# EasyEDA Pro project ProPrj_51单片机核心板_2025-11-10-23-27-29.epro

# Schematic 51单片机核心板原理图
Board Name: 51单片机核心板; Create Date: 2025-10-25; Page Name: P1; Project Name: 51单片机核心板; Schematic Name: 51单片机核心板原理图; Update Date: 2025-10-27; Company: HFUT; Drawed: 孟一冉; Page Size: A4; Version: V1.0
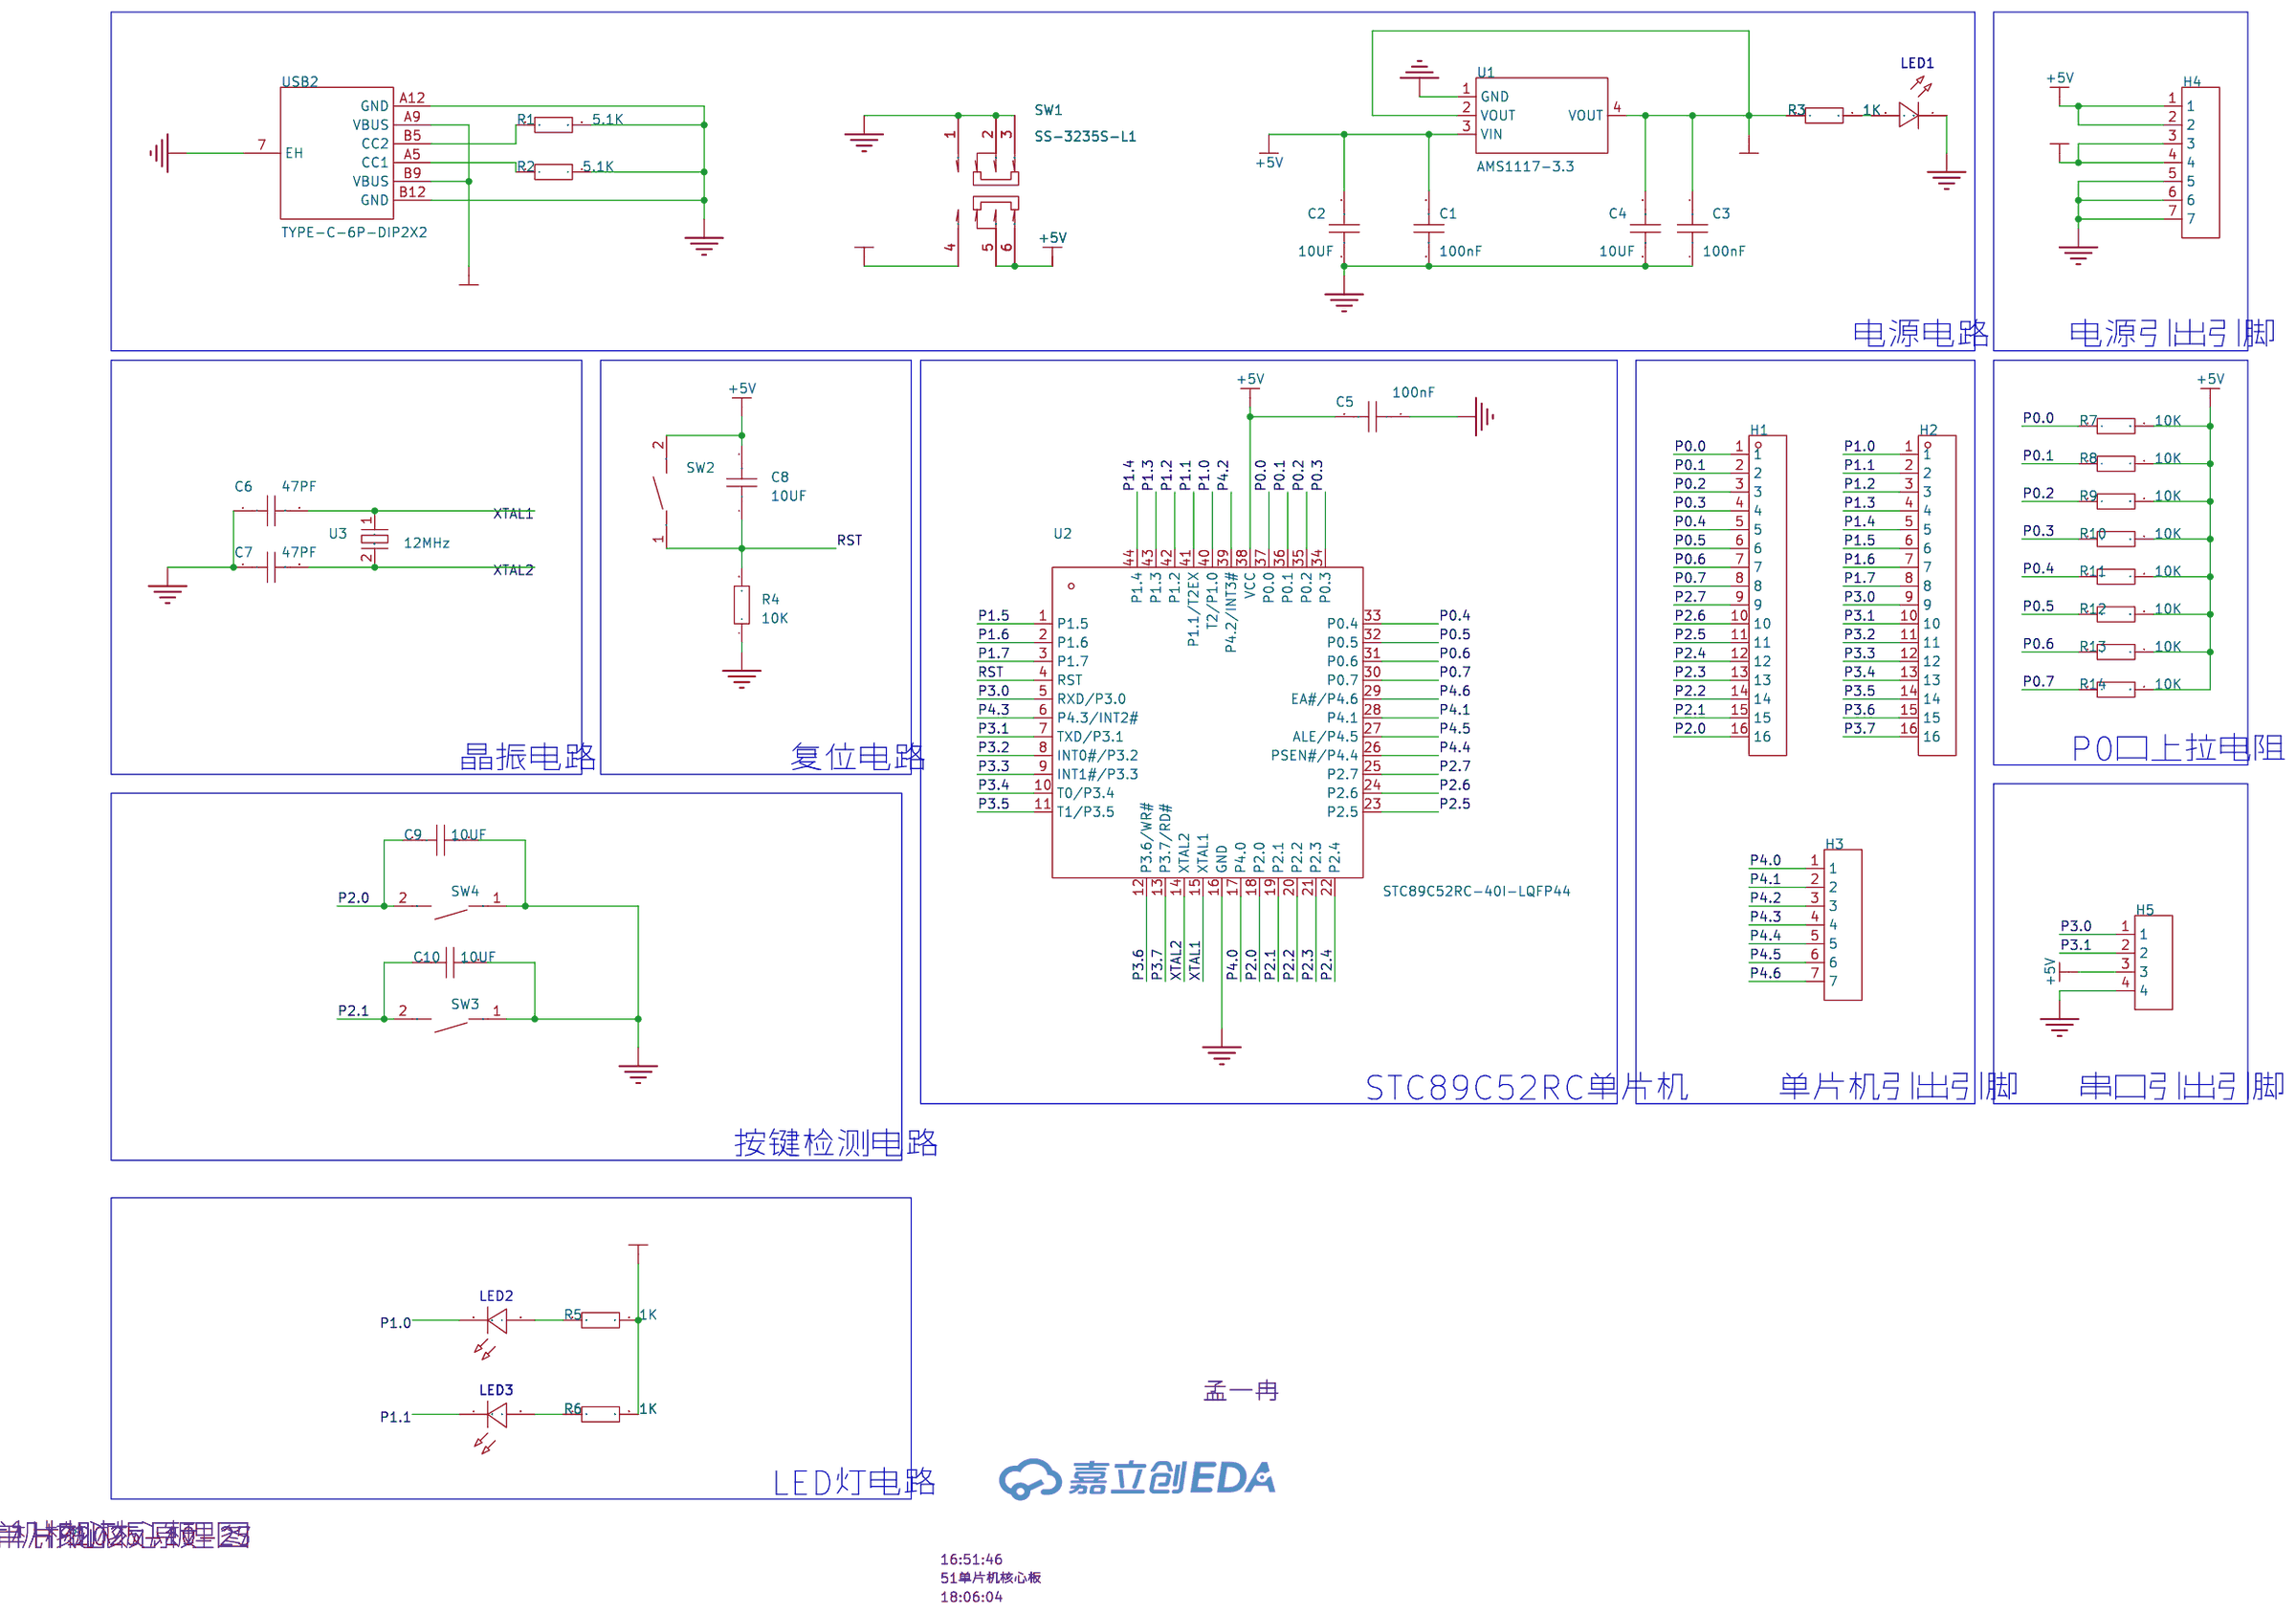
[diagram p0: schematic sheet]

## Parts
C1  100nF  [C0805]
C2  10UF  [C0805]
C3  100nF  [C0805]
C4  10UF  [C0805]
C5  100nF  [C0805]
C6  47PF  [C0805]
C7  47PF  [C0805]
C8  10UF  [C0805]
C9  10UF  [C0805]
C10  10UF  [C0805]
H1  -  [HDR-TH_16P-P2.54-V-M]
H2  -  [HDR-TH_16P-P2.54-V-M]
H3  -  [HDR-TH_7P-P2.54-V-M]
H4  -  [HDR-TH_7P-P2.54-V-M]
H5  -  [HDR-TH_4P-P2.54-V-M]
LED1  -  [LED_0805]
LED2  -  [LED_0805]
LED3  -  [LED_0805]
R1  5.1K  [R0805]
R2  5.1K  [R0805]
R3  1K  [R0805]
R4  10K  [R0805]
R5  1K  [R0805]
R6  1K  [R0805]
R7  10K  [R0805]
R8  10K  [R0805]
R9  10K  [R0805]
R10  10K  [R0805]
R11  10K  [R0805]
R12  10K  [R0805]
R13  10K  [R0805]
R14  10K  [R0805]
SW1  SS-3235S-L1  [SW-SMD_SS-3235S-LX]
SW2  轻触按键3*4*H  [SW-SMD_L4.0-W2.9-LS5.0]
SW3  轻触按键3*4*H  [SW-SMD_L4.0-W2.9-LS5.0]
SW4  轻触按键3*4*H  [SW-SMD_L4.0-W2.9-LS5.0]
U1  AMS1117-3.3  [SOT-223-3_L6.5-W3.4-P2.30-LS7.0-BR]
U2  STC89C52RC-40I-LQFP44  [LQFP-44_L10.0-W10.0-P0.80-LS12.0-BL]
U3  12MHz  [CRYSTAL-SMD_L11.4-W4.7-LS12.7]
USB2  TYPE-C-6P-DIP2X2  [TYPE-C-SMD_TYPE-C-6P]

## Library data of the parts
C1-C10 = CAP_0805: Supplier Footprint: 0805
H1 H2 = HDR-M_2.54_1x16P: 间距:2.54mm;总PIN位数:16;排数:1;插针结构:1x16P;行距:-;安装类型:直插;圆针/方针:方针;额定电流:3A;额定电压:-;配合针长度:6mm;塑高:2.5mm;端接针长度:3mm;触头材质:-;工作温度范围:-40℃~+105℃;颜色:黑色;; Supplier Part: C2894939; Supplier Footprint: 插件
H3 H4 = HDR-M_2.54_1x7P: Supplier Part: C492406; Supplier Footprint: 插件
H5 = HDR-M_2.54_1x4P: Supplier Part: C492403; Supplier Footprint: 插件
LED1-LED3 = LED_0805-G: Supplier Footprint: 0805
R1-R14 = Res_0805: Supplier Footprint: 0805
SW1 = SS-3235S-L1: 电路结构:双刀双掷;安装方式:卧贴;开关颜色:黑色;额定电流:50mA;额定电压:12V;工作寿命:1万次;; LCSC Part Name: 柄长2mm 卧贴双档 滑动开关; Supplier Part: C500055; Manufacturer: XKB Connection(中国星坤); Supplier Footprint: SMD,9.1x3.6mm; JLCPCB Part Class: 扩展库; Datasheet: https://item.szlcsc.com/datasheet/SS-3235S-L1/512181.html; Supplier: LCSC; Circuit: 双刀双掷; Actuator Style: 矩形柱状; Termination Style: 鸥翼型; Length: 9.1mm; Width: 3.55mm; Switch Height: 3.2mm; Mounting Type: 卧贴; Actuator Color: 黑色; Current Rating: 50mA; Voltage Rating: 12V; Life: 1万次; Operating Temperature: -40℃~+85℃
SW2-SW4 = 轻触按键3*4*H: Supplier Part: C9900017573; Supplier Footprint: 轻触按键3*4*2.5; JLCPCB Part Class: 扩展库; Supplier: LCSC
U1 = AMS1117-3.3_C6186: 输出类型:固定;工作电压:16V;输出电压:3.3V;输出电流:1A;电源纹波抑制比(PSRR):72dB@(120Hz);输出极性:正极;; LCSC Part Name: 输出3.3V 1A; Supplier Part: C6186; Manufacturer: AMS; Supplier Footprint: SOT-223; JLCPCB Part Class: 基础库; Datasheet: https://item.szlcsc.com/datasheet/AMS1117-3.3/6652.html; Supplier: LCSC; Output Type: 固定; Voltage - Supply: 16V; Output Voltage: 3.3V; Output Current: 1A; Power Supply Rejection Ratio (PSRR): 72dB@(120Hz); Voltage Dropout: 1.1V@(800mA); standby current: 5mA; Noise: 0.003%Vout; Features: 过流保护；过热保护; Operating Temperature: -40℃~+125℃; Output Configuration: 正极; Number of Outputs: 1
U2 = STC89C52RC-40I-LQFP44: CPU内核:51系列;应用领域:-;; Supplier Part: C8707; Manufacturer: STC; Supplier Footprint: LQFP-44(10x10); JLCPCB Part Class: 扩展库; Datasheet: https://atta.szlcsc.com/upload/public/pdf/source/20241226/242305099CBBF4767F79975207B2F263.pdf; Supplier: LCSC; CPU Core: 51系列; Program Storage Size: 8KB; Program Memory Type: FLASH; Number of I/O: 39; Low Voltage Detection Threshold: 3.3V~5.5V
U3 = ABLS-12.000MHZ-B4H-T: 频率:12MHz;常温频差:±30ppm;外接负载电容:18pF;频率稳定度(全温):±35ppm;; LCSC Part Name: 12MHz ±30ppm 18pF; Supplier Part: C1986452; Manufacturer: ABRACON; Supplier Footprint: HC-49S-SMD; JLCPCB Part Class: 扩展库; Datasheet: https://atta.szlcsc.com/upload/public/pdf/source/20210612/96A8D0E14BE5C26ADD56CBF11909D043.pdf; Supplier: LCSC; Normal temperature Frequency Tolerance: ±30ppm; External load capacitor: 18pF; Frequency Stability(Full temperature range): ±35ppm; Equivalent Series Resistance (ESR): 50Ω; Operating Temperature: -20℃~+70℃
USB2 = TYPE-C-6P-DIP2X2: Supplier Part: C9900017627; Supplier Footprint: TYPE-C-6P; JLCPCB Part Class: 扩展库; Supplier: LCSC

## Nets
+3.3V: C3.2 C4.2 H4.3 H4.4 R3.1 R5.2 R6.2 U1.2(VOUT) U1.4(VOUT)
+5V: C1.2 C2.2 C5.2 C8.2 H4.1 H4.2 H5.3 R7.2 R8.2 R9.2 R10.2 R11.2 R12.2 R13.2 R14.2 SW1.5 SW1.6 SW2.2 U1.3(VIN) U2.38(VCC)
GND: C1.1 C2.1 C3.1 C4.1 C5.1 C6.1 C7.1 C9.2 C10.2 H4.5 H4.6 H4.7 H5.4 LED1.1(C) R1.2 R2.2 R4.1 SW1.1 SW1.2 SW1.3 SW3.1 SW4.1 U1.1(GND) U2.16(GND) USB2.7(EH) USB2.A12(GND) USB2.B12(GND)
VCC+5V: SW1.4 USB2.A9(VBUS) USB2.B9(VBUS)
P0.0: H1.1 R7.1 U2.37(P0.0)
P0.1: H1.2 R8.1 U2.36(P0.1)
P0.2: H1.3 R9.1 U2.35(P0.2)
P0.3: H1.4 R10.1 U2.34(P0.3)
P0.4: H1.5 R11.1 U2.33(P0.4)
P0.5: H1.6 R12.1 U2.32(P0.5)
P0.6: H1.7 R13.1 U2.31(P0.6)
P0.7: H1.8 R14.1 U2.30(P0.7)
P1.0: H2.1 LED2.1(C) U2.40(T2/P1.0)
P1.1: H2.2 LED3.1(C) U2.41(P1.1/T2EX)
P1.2: H2.3 U2.42(P1.2)
P1.3: H2.4 U2.43(P1.3)
P1.4: H2.5 U2.44(P1.4)
P1.5: H2.6 U2.1(P1.5)
P1.6: H2.7 U2.2(P1.6)
P1.7: H2.8 U2.3(P1.7)
P2.0: C9.1 H1.16 SW4.2 U2.18(P2.0)
P2.1: C10.1 H1.15 SW3.2 U2.19(P2.1)
P2.2: H1.14 U2.20(P2.2)
P2.3: H1.13 U2.21(P2.3)
P2.4: H1.12 U2.22(P2.4)
P2.5: H1.11 U2.23(P2.5)
P2.6: H1.10 U2.24(P2.6)
P2.7: H1.9 U2.25(P2.7)
P3.0: H2.9 H5.1 U2.5(RXD/P3.0)
P3.1: H2.10 H5.2 U2.7(TXD/P3.1)
P3.2: H2.11 U2.8(INT0#/P3.2)
P3.3: H2.12 U2.9(INT1#/P3.3)
P3.4: H2.13 U2.10(T0/P3.4)
P3.5: H2.14 U2.11(T1/P3.5)
P3.6: H2.15 U2.12(P3.6/WR#)
P3.7: H2.16 U2.13(P3.7/RD#)
P4.0: H3.1 U2.17(P4.0)
P4.1: H3.2 U2.28(P4.1)
P4.2: H3.3 U2.39(P4.2/INT3#)
P4.3: H3.4 U2.6(P4.3/INT2#)
P4.4: H3.5 U2.26(PSEN#/P4.4)
P4.5: H3.6 U2.27(ALE/P4.5)
P4.6: H3.7 U2.29(EA#/P4.6)
RST: C8.1 R4.2 SW2.1 U2.4(RST)
XTAL1: C6.2 U2.15(XTAL1) U3.1
XTAL2: C7.2 U2.14(XTAL2) U3.2(GND)
Net-(LED1-2): LED1.2(A) R3.2
Net-(LED2-2): LED2.2(A) R5.1
Net-(LED3-2): LED3.2(A) R6.1
Net-(R1-1): R1.1 USB2.B5(CC2)
Net-(R2-1): R2.1 USB2.A5(CC1)

## Notes on the sheet
- 电源电路
- 电源引出引脚
- 晶振电路
- 复位电路
- P0口上拉电阻
- STC89C52RC单片机
- 单片机引出引脚
- 串口引出引脚
- 按键检测电路
- LED灯电路

# Board 51单片机核心板PCB
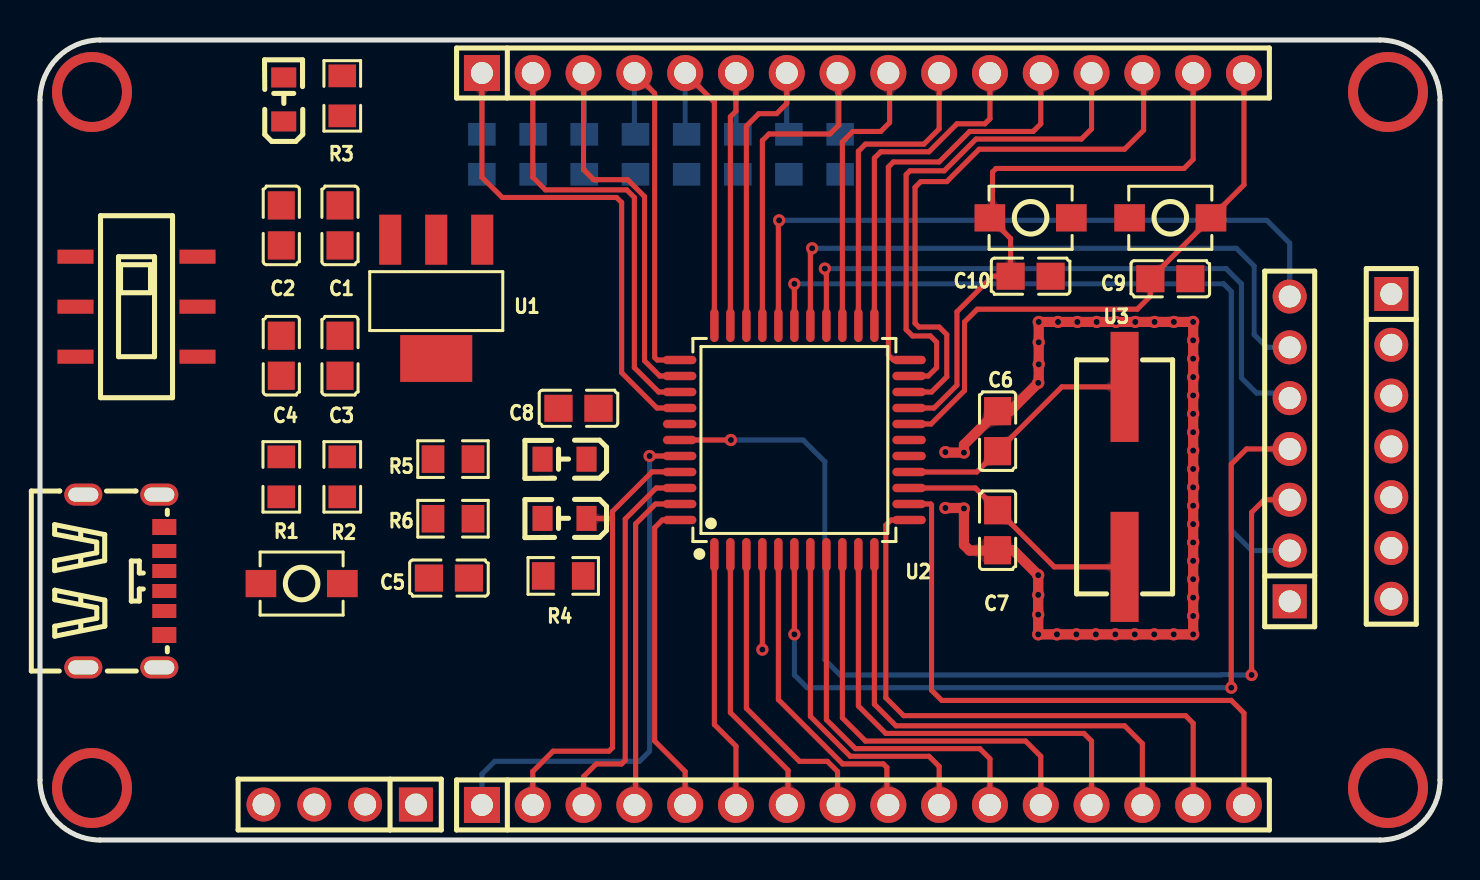
[diagram p1: board, top side]
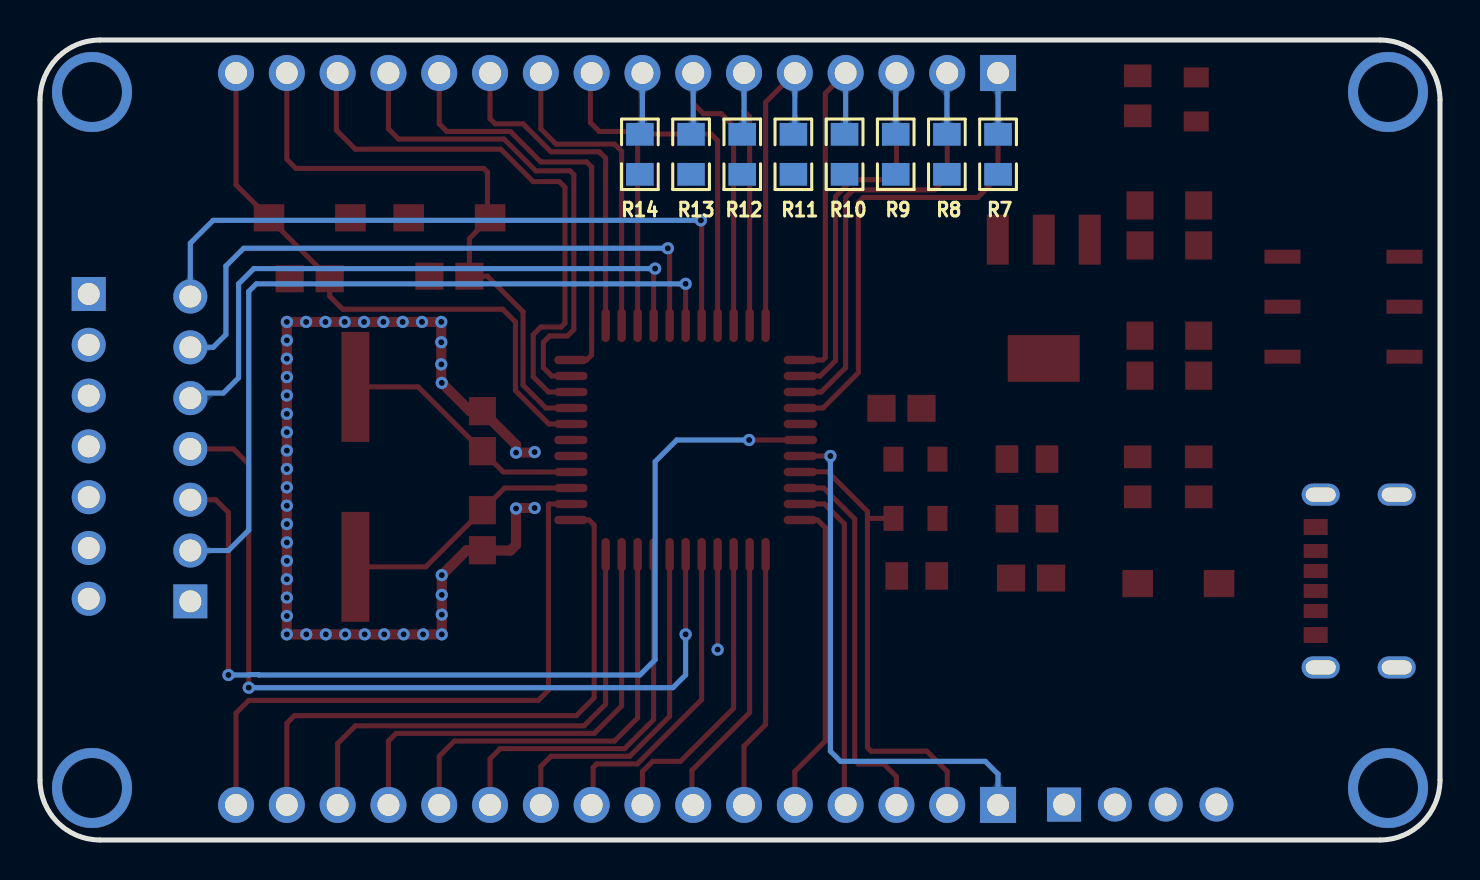
[diagram p2: board, bottom side, seen from below]

Outline 70 x 40 mm; copper layers: Top Layer, Bottom Layer. Coordinates in mm from the lower left corner of the outline.
Outline path: 0,37 0,3 arc(0.88,0.88) 3,0 67,0 arc(69.12,0.88) 70,3 70,37 arc(69.12,39.12) 67,40 3,40 arc(0.88,39.12) 0,37
Stack: Top Layer 0.035mm / Dielectric1 1.51mm FR4 er 4.5 / Bottom Layer 0.035mm

## Design rules (mm)
net XTAL1: DP1
net XTAL2: DP1
template: JLCPCB Capability(Two Layers Board)
spacing copperThickness1oz (default): track to track 0.102, other pairs 0.152 to 0.3
spacing copperThickness2oz: track to track 0.203, other pairs 0.152 to 0.3
track width copperThickness1oz (default): min 0.127, default 0.254, max 2.54
track width copperThickness2oz: min 0.203, default 0.254, max 2.54
differential pair differentialPair (default): width min 0.127, default 0.254, max 2.54; gap min 0.152, default 0.152
via viaSize (default): diameter min 0.5, default 0.61, max 10; hole min 0.3, default 0.305, max 6.3

## Placement (name value [footprint] x y rotation side)
C1  100nF  [C0805]  15 30.73 90 top
C2  10UF  [C0805]  12.06 30.73 90 top
C3  100nF  [C0805]  15 24.21 90 top
C4  10UF  [C0805]  12.06 24.21 90 top
C5  100nF  [C0805]  20.45 13.1 180 top
C6  47PF  [C0805]  47.88 20.44 270 top
C7  47PF  [C0805]  47.88 15.49 90 top
C8  10UF  [C0805]  26.92 21.58 0 top
C9  10UF  [C0805]  56.51 28.06 0 top
C10  10UF  [C0805]  49.53 28.19 0 top
NOREF  -  [HDR-TH_7P-P2.54-V-M]  62.48 19.55 90 top
NOREF#2  -  [HDR-TH_7P-P2.54-V-M]  67.56 19.68 270 top
NOREF#3  -  [SW-SMD_SS-3235S-LX]  4.83 26.67 90 top
NOREF#4  -  [SW-SMD_L4.0-W2.9-LS5.0]  13.08 12.82 180 top
NOREF#5  -  [SW-SMD_L4.0-W2.9-LS5.0]  49.53 31.11 180 top
NOREF#6  -  [SW-SMD_L4.0-W2.9-LS5.0]  56.51 31.11 0 top
NOREF#7  -  [HDR-TH_16P-P2.54-V-M]  41.15 38.35 0 top
NOREF#8  -  [HDR-TH_16P-P2.54-V-M]  41.15 1.75 0 top
NOREF#9  -  [LED_0805]  12.19 37.08 90 top
NOREF#10  -  [LED_0805]  26.18 19.05 180 top
NOREF#11  -  [LED_0805]  26.18 16.08 180 top
NOREF#12  -  [HDR-TH_4P-P2.54-V-M]  14.99 1.77 180 top
NOREF#13  -  [TYPE-C-SMD_TYPE-C-6P]  4.19 12.95 270 top
R1  5.1K  [R0805]  12.06 18.16 270 top
R2  5.1K  [R0805]  15.11 18.16 270 top
R3  1K  [R0805]  15.11 37.21 90 top
R4  10K  [R0805]  26.16 13.2 0 top
R5  1K  [R0805]  20.65 19.05 180 top
R6  1K  [R0805]  20.65 16.06 180 top
R7  10K  [R0805]  22.1 34.28 270 bottom
R8  10K  [R0805]  24.66 34.28 270 bottom
R9  10K  [R0805]  27.21 34.28 270 bottom
R10  10K  [R0805]  29.77 34.28 270 bottom
R11  10K  [R0805]  32.33 34.28 270 bottom
R12  10K  [R0805]  34.89 34.28 270 bottom
R13  10K  [R0805]  37.45 34.28 270 bottom
R14  10K  [R0805]  40 34.28 270 bottom
U1  AMS1117-3.3  [SOT-223-3_L6.5-W3.4-P2.30-LS7.0-BR]  19.81 27.05 90 top
U2  STC89C52RC-40I-LQFP44  [LQFP-44_L10.0-W10.0-P0.80-LS12.0-BL]  37.72 20 0 top
U3  12MHz  [CRYSTAL-SMD_L11.4-W4.7-LS12.7]  54.23 18.16 270 top

## Footprints (pads in the part's own frame, mm; a bottom-side part is the same pattern mirrored in y, then rotated)
C0805
  rect 1.41x1.35 smd: 1(-1,0) 2(1,0)
CRYSTAL-SMD_L11.4-W4.7-LS12.7
  rect 5.5x1.4 smd: 1(-4.5,0) 2(4.5,0)
HDR-TH_4P-P2.54-V-M
  rect 1.7x1.7 hole 1.1: 1(-3.81,0)
  round 1.7 hole 1.1: 2(-1.27,0) 3(1.27,0) 4(3.81,0)
HDR-TH_7P-P2.54-V-M
  rect 1.7x1.7 hole 1.1: 1(-7.62,0)
  round 1.7 hole 1.1: 2(-5.08,0) 3(-2.54,0) 4(0,0) 5(2.54,0) 6(5.08,0) 7(7.62,0)
HDR-TH_16P-P2.54-V-M
  rect 1.8x1.8 hole 1.1: 1(-19.05,0)
  round 1.8 hole 1.1: 2(-16.51,0) 3(-13.97,0) 4(-11.43,0) 5(-8.89,0) 6(-6.35,0) 7(-3.81,0) 8(-1.27,0) 9(1.27,0) 10(3.81,0) 11(6.35,0) 12(8.89,0) 13(11.43,0) 14(13.97,0) 15(16.51,0) 16(19.05,0)
LED_0805
  rect 1x1.25 smd: 1(-1.15,0.005) 2(1.05,0.005)
LQFP-44_L10.0-W10.0-P0.80-LS12.0-BL
  oval 0.42x1.67 smd: 1(-4,-5.735) 2(-3.2,-5.735) 3(-2.4,-5.735) 4(-1.6,-5.735) 5(-0.8,-5.735) 6(0,-5.735) 7(0.8,-5.735) 8(1.6,-5.735) 9(2.4,-5.735) 10(3.2,-5.735) 11(4,-5.735) 23(4,5.735) 24(3.2,5.735) 25(2.4,5.735) 26(1.6,5.735) 27(0.8,5.735) 28(0,5.735) 29(-0.8,5.735) 30(-1.6,5.735) 31(-2.4,5.735) 32(-3.2,5.735) 33(-4,5.735)
  oval 1.67x0.42 smd: 12(5.735,-4) 13(5.735,-3.2) 14(5.735,-2.4) 15(5.735,-1.6) 16(5.735,-0.8) 17(5.735,0) 18(5.735,0.8) 19(5.735,1.6) 20(5.735,2.4) 21(5.735,3.2) 22(5.735,4) 34(-5.735,4) 35(-5.735,3.2) 36(-5.735,2.4) 37(-5.735,1.6) 38(-5.735,0.8) 39(-5.735,0) 40(-5.735,-0.8) 41(-5.735,-1.6) 42(-5.735,-2.4) 43(-5.735,-3.2) 44(-5.735,-4)
R0805
  rect 1.133x1.377 smd: 1(-1,0) 2(1,0)
SOT-223-3_L6.5-W3.4-P2.30-LS7.0-BR
  rect 2.5x1.1 smd: 1(2.97,-2.3) 2(2.97,0) 3(2.97,2.3)
  rect 2.34x3.6 smd: 4(-2.97,0)
SW-SMD_L4.0-W2.9-LS5.0
  rect 1.53x1.36 smd: 1(-2.035,0) 2(2.035,0)
SW-SMD_SS-3235S-LX
  rect 0.7x1.8 smd: 1(-2.5,3.05) 2(0,3.05) 3(2.5,3.05) 4(-2.5,-3.05) 5(0,-3.05) 6(2.5,-3.05)
TYPE-C-SMD_TYPE-C-6P
  oval 1.1x1.9 hole 0.7x1.5: 7(-4.32,1.775) 7(-4.32,-2.025) 7(4.32,1.775) 7(4.32,-2.025)
  rect 0.7x1.2 smd: A5(-0.5,2.025) A9(1.5,2.025) B5(0.5,2.025) B9(-1.5,2.025)
  rect 0.8x1.2 smd: A12(2.7,2.025) B12(-2.7,2.025)

## Nets
+3.3V: C3.2 C4.2 NOREF#2.3 NOREF#2.4 R3.1 R5.2 R6.2 U1.2 U1.4
+5V: C1.2 C2.2 C5.2 C8.2 NOREF#2.1 NOREF#2.2 NOREF#3.5 NOREF#3.6 NOREF#4.2 NOREF#12.3 R7.2 R8.2 R9.2 R10.2 R11.2 R12.2 R13.2 R14.2 U1.3 U2.38
GND: C1.1 C2.1 C3.1 C4.1 C5.1 C6.1 C7.1 C9.2 C10.2 NOREF#2.5 NOREF#2.6 NOREF#2.7 NOREF#3.1 NOREF#3.2 NOREF#3.3 NOREF#5.1 NOREF#6.1 NOREF#9.1 NOREF#12.4 NOREF#13.7 NOREF#13.A12 NOREF#13.B12 R1.2 R2.2 R4.1 U1.1 U2.16
VCC+5V: NOREF#3.4 NOREF#13.A9 NOREF#13.B9
P0.0: NOREF#7.1 R7.1 U2.37
P0.1: NOREF#7.2 R8.1 U2.36
P0.2: NOREF#7.3 R9.1 U2.35
P0.3: NOREF#7.4 R10.1 U2.34
P0.4: NOREF#7.5 R11.1 U2.33
P0.5: NOREF#7.6 R12.1 U2.32
P0.6: NOREF#7.7 R13.1 U2.31
P0.7: NOREF#7.8 R14.1 U2.30
P1.0: NOREF#8.1 NOREF#10.1 U2.40
P1.1: NOREF#8.2 NOREF#11.1 U2.41
P1.2: NOREF#8.3 U2.42
P1.3: NOREF#8.4 U2.43
P1.4: NOREF#8.5 U2.44
P1.5: NOREF#8.6 U2.1
P1.6: NOREF#8.7 U2.2
P1.7: NOREF#8.8 U2.3
P2.0: C9.1 NOREF#6.2 NOREF#7.16 U2.18
P2.1: C10.1 NOREF#5.2 NOREF#7.15 U2.19
P2.2: NOREF#7.14 U2.20
P2.3: NOREF#7.13 U2.21
P2.4: NOREF#7.12 U2.22
P2.5: NOREF#7.11 U2.23
P2.6: NOREF#7.10 U2.24
P2.7: NOREF#7.9 U2.25
P3.0: NOREF#8.9 NOREF#12.1 U2.5
P3.1: NOREF#8.10 NOREF#12.2 U2.7
P3.2: NOREF#8.11 U2.8
P3.3: NOREF#8.12 U2.9
P3.4: NOREF#8.13 U2.10
P3.5: NOREF#8.14 U2.11
P3.6: NOREF#8.15 U2.12
P3.7: NOREF#8.16 U2.13
P4.0: NOREF.1 U2.17
P4.1: NOREF.2 U2.28
P4.2: NOREF.3 U2.39
P4.3: NOREF.4 U2.6
P4.4: NOREF.5 U2.26
P4.5: NOREF.6 U2.27
P4.6: NOREF.7 U2.29
RST: C8.1 NOREF#4.1 R4.2 U2.4
XTAL1: C6.2 U2.15 U3.1
XTAL2: C7.2 U2.14 U3.2
$1N425: NOREF#13.B5 R1.1
$1N430: NOREF#13.A5 R2.1
$1N1013: NOREF#9.2 R3.2
$1N3788: NOREF#10.2 R5.1
$1N3792: NOREF#11.2 R6.1

## Via types
v1: diameter 4, hole 3, Top Layer to Bottom Layer, 4 vias
v2: diameter 0.61, hole 0.305, Top Layer to Bottom Layer, 54 vias

## Routing (per net, layer and track width the routed paths; a pad name or vN(x,y) marks a point on that pad's centre or on a via; arc(x,y) is an arc through that point)
GND: length 50.5
  Top Layer w0.508: v2(45.27,19.39) 45.29,19.37 v2(46.2,19.37) 46.2,19.76 C6.1 48.5,21.44 v2(49.91,22.86) 49.94,22.88 v2(49.94,23.78) v2(49.94,24.89) v2(49.94,25.9) v2(50.9,25.9) v2(51.87,25.9) v2(52.83,25.9) v2(53.8,25.9) v2(54.76,25.9) v2(55.73,25.9) v2(56.69,25.9) v2(57.66,25.9) v2(57.66,24.98) v2(57.66,24.06) v2(57.66,23.15) v2(57.66,22.23) v2(57.66,21.31) v2(57.66,20.39) v2(57.66,19.47) v2(57.66,18.55) v2(57.66,17.63) v2(57.66,16.71) v2(57.66,15.8) v2(57.66,14.88) v2(57.66,13.96) v2(57.66,13.04) v2(57.66,12.12) v2(57.66,11.2) v2(57.66,10.28) v2(56.69,10.28) v2(55.71,10.28) v2(54.74,10.28) v2(53.77,10.28) v2(52.79,10.28) v2(51.82,10.28) v2(50.85,10.28) v2(49.91,10.28) v2(49.91,11.27) v2(49.91,12.26) v2(49.91,13.24) 48.66,14.49 C7.1 47.86,14.47 46.48,14.47 46.2,14.76 v2(46.2,16.58) 46.17,16.6 v2(45.27,16.6)
(no net):
  vias: v1(2.6,37.4) v1(2.6,2.6) v1(67.4,37.4) v1(67.4,2.6)
P0.0: length 27.9
  Top Layer w0.254: NOREF#7.1 22.1,33.14 23.11,32.13 28.83,32.13 29.08,31.87 29.08,23.36 30.85,21.6 U2.37
  Bottom Layer w0.254: R7.1 NOREF#7.1
P0.1: length 25.1
  Top Layer w0.254: NOREF#7.2 24.64,33.14 25.27,32.51 29.34,32.51 29.72,32.13 29.72,23.62 30.94,22.4 U2.36
  Bottom Layer w0.254: NOREF#7.2 24.66,38.33 R8.1
P0.2: length 21.8
  Top Layer w0.254: U2.35 30.99,23.2 30.23,23.96 30.23,32.17 29.38,33.02 27.69,33.02 27.18,33.52 NOREF#7.3
  Bottom Layer w0.254: NOREF#7.3 27.21,38.31 R9.1
P0.3: length 19
  Top Layer w0.254: NOREF#7.4 30.73,37.33 30.73,24.12 30.86,24 U2.34
  Bottom Layer w0.254: R10.1 29.72,35.34 NOREF#7.4
P0.4: length 16.3
  Top Layer w0.254: NOREF#7.5 33.72,36.89 U2.33
  Bottom Layer w0.254: NOREF#7.5 32.26,35.36 R11.1
P0.5: length 15.8
  Top Layer w0.254: NOREF#7.6 34.8,36.44 34.52,36.17 U2.32
  Bottom Layer w0.254: NOREF#7.6 34.8,35.38 R12.1
P0.6: length 17.1
  Top Layer w0.254: U2.31 35.32,35.69 35.94,36.32 36.83,36.32 37.34,36.83 NOREF#7.7
  Bottom Layer w0.254: NOREF#7.7 37.34,35.39 R13.1
P0.7: length 19.1
  Top Layer w0.254: NOREF#7.8 39.94,38.29 39.94,35.75 39.5,35.3 36.45,35.3 36.12,34.97 U2.30
  Bottom Layer w0.254: NOREF#7.8 39.88,35.41 R14.1
P1.0: length 26.7
  Top Layer w0.254: U2.40 v2(30.48,19.2)
  Bottom Layer w0.254: NOREF#8.1 22.1,3.3 22.73,3.93 29.97,3.93 30.48,4.44 v2(30.48,19.2)
P1.1: length 23.5
  Top Layer w0.254: 28.63,16.13 28.63,16.43 30.61,18.41 31.97,18.41 U2.41 ; 28.63,16.13 28.63,4.62 28.45,4.44 25.65,4.44 24.64,3.42 NOREF#8.2 ; 28.63,16.13 28.58,16.08 NOREF#11.1
P1.2: length 19.3
  Top Layer w0.254: U2.42 30.81,17.6 29.26,16.05 29.26,3.98 29.08,3.81 27.81,3.81 27.18,3.17 NOREF#8.3
P1.3: length 16.7
  Top Layer w0.254: NOREF#8.4 29.78,1.82 29.78,15.81 30.78,16.8 U2.43
P1.4: length 15.9
  Top Layer w0.254: NOREF#8.5 32.26,3.42 30.73,4.95 30.73,15.62 31.12,16 U2.44
P1.5: length 13
  Top Layer w0.254: NOREF#8.6 34.8,4.69 33.72,5.77 U2.1
P1.6: length 13.7
  Top Layer w0.254: U2.2 34.52,6.37 37.4,3.49 37.4,1.82 NOREF#8.7
P1.7: length 15.2
  Top Layer w0.254: U2.3 35.32,6.59 37.97,3.93 39.37,3.93 39.88,3.42 NOREF#8.8
P2.0: length 29.8
  Top Layer w0.254: NOREF#7.16 60.2,32.76 NOREF#6.2 58.55,31.1 C9.1 55.51,27.19 54.86,26.54 46.86,26.54 46.23,25.9 46.23,22.47 44.55,20.8 U2.18
P2.1: length 30.3
  Top Layer w0.254: NOREF#7.15 57.66,34.03 57.2,33.58 47.8,33.58 47.62,33.4 47.62,31.24 NOREF#5.2 48.53,30.08 C10.1 47.62,28.19 45.85,26.41 45.85,22.74 44.7,21.6 U2.19
P2.2: length 28.4
  Top Layer w0.254: NOREF#7.14 55.18,38.29 55.18,35.49 54.23,34.54 46.96,34.54 45.34,32.92 44.04,32.92 43.75,32.63 43.75,25.84 43.94,25.65 44.96,25.65 45.34,25.27 45.34,23.16 44.58,22.4 U2.20
P2.3: length 25.4
  Top Layer w0.254: U2.21 44.41,23.2 44.83,23.62 44.83,24.89 44.51,25.2 43.62,25.2 43.31,25.52 43.31,33.27 43.5,33.46 45.21,33.46 46.8,35.05 52.07,35.05 52.58,35.56 NOREF#7.13
P2.4: length 21.6
  Top Layer w0.254: U2.22 42.67,24 42.42,24.25 42.42,33.65 42.67,33.9 44.96,33.9 46.48,35.43 49.66,35.43 50.04,35.81 NOREF#7.12
P2.5: length 17.2
  Top Layer w0.254: U2.23 41.72,34.09 42.04,34.41 44.45,34.41 45.85,35.81 47.24,35.81 47.5,36.06 NOREF#7.11
P2.6: length 16
  Top Layer w0.254: NOREF#7.10 44.96,35.56 44.2,34.79 41.28,34.79 40.92,34.44 40.92,25.73
P2.7: length 14.4
  Top Layer w0.254: NOREF#7.9 42.48,38.29 42.48,35.87 42.04,35.43 40.64,35.43 40.12,34.91 U2.25
P3.0: length 16
  Top Layer w0.254: NOREF#8.9 42.34,1.83 42.34,3.63 42.16,3.81 40.13,3.81 36.92,7.02 36.92,14.27
P3.1: length 17.5
  Top Layer w0.254: NOREF#8.10 44.96,3.68 44.45,4.19 40.51,4.19 38.52,6.18 U2.7
P3.2: length 19.5
  Top Layer w0.254: U2.8 39.32,6.02 40.77,4.57 46.99,4.57 47.5,4.06 NOREF#8.11
P3.3: length 21.3
  Top Layer w0.254: NOREF#8.12 50.04,4.19 49.28,4.95 41.28,4.95 40.12,6.1 U2.9
P3.4: length 23.1
  Top Layer w0.254: 40.92,14.27 40.92,6.7 42.29,5.33 52.2,5.33 52.58,4.95 NOREF#8.13
P3.5: length 24.8
  Top Layer w0.254: U2.11 41.72,6.79 42.8,5.71 54.23,5.71 55.12,4.82 NOREF#8.14
P3.6: length 29.9
  Top Layer w0.254: NOREF#8.15 57.66,5.84 57.28,6.22 43.18,6.22 42.29,7.11 42.29,15.74 42.55,16 U2.12
P3.7: length 31.1
  Top Layer w0.254: U2.13 44.54,16.8 44.58,16.76 44.58,7.49 45.09,6.98 59.56,6.98 60.2,6.34 NOREF#8.16
P4.1: length 39.4
  Top Layer w0.254: U2.28 v2(37.72,27.81)
  Bottom Layer w0.254: NOREF.2 60.58,14.47 59.56,15.49 59.56,27.43 59.18,27.81 v2(37.72,27.81)
P4.2: length 49.6
  Top Layer w0.254: U2.39 v2(34.54,20) ; NOREF.3 61.21,17.01 60.58,16.38 v2(60.58,8.25)
  Bottom Layer w0.254: v2(34.54,20) 38.16,20 39.24,18.92 39.24,9.01 40,8.25 59.05,8.25 59.07,8.27 59.54,8.27 59.56,8.25 v2(60.58,8.25)
P4.3: length 42.5
  Top Layer w0.254: U2.6 v2(37.72,10.28) ; NOREF.4 60.32,19.55 59.56,18.79 v2(59.56,7.61)
  Bottom Layer w0.254: v2(59.56,7.61) 38.35,7.61 37.72,8.25 v2(37.72,10.28)
P4.4: length 31.5
  Top Layer w0.254: v2(39.24,28.57) 39.32,28.49 U2.26
  Bottom Layer w0.254: NOREF.5 62.23,22.35 60.83,22.35 60.07,23.11 60.07,27.81 59.31,28.57 v2(39.24,28.57)
P4.5: length 31.8
  Top Layer w0.254: U2.27 38.52,29.5 v2(38.61,29.59)
  Bottom Layer w0.254: NOREF.6 61.34,24.63 60.71,25.27 60.71,28.7 59.82,29.59 v2(38.61,29.59)
P4.6: length 33.9
  Top Layer w0.254: 36.92,25.73 36.92,30.94 v2(36.96,30.98)
  Bottom Layer w0.254: v2(36.96,30.98) 61.34,30.98 62.48,29.84 NOREF.7
RST: length 4.7
  Top Layer w0.254: U2.4 v2(36.12,9.52)
XTAL1: length 12.5
  Top Layer w0.254: U2.15 46.84,18.4 C6.2 51.09,22.66 U3.1
XTAL2: length 12.4
  Top Layer w0.254: U2.14 46.77,17.6 C7.2 50.71,13.66 U3.2

Small or netless copper shapes (teardrops, artwork), in the pictures only: 177 on Top Layer, 30 on Bottom Layer
